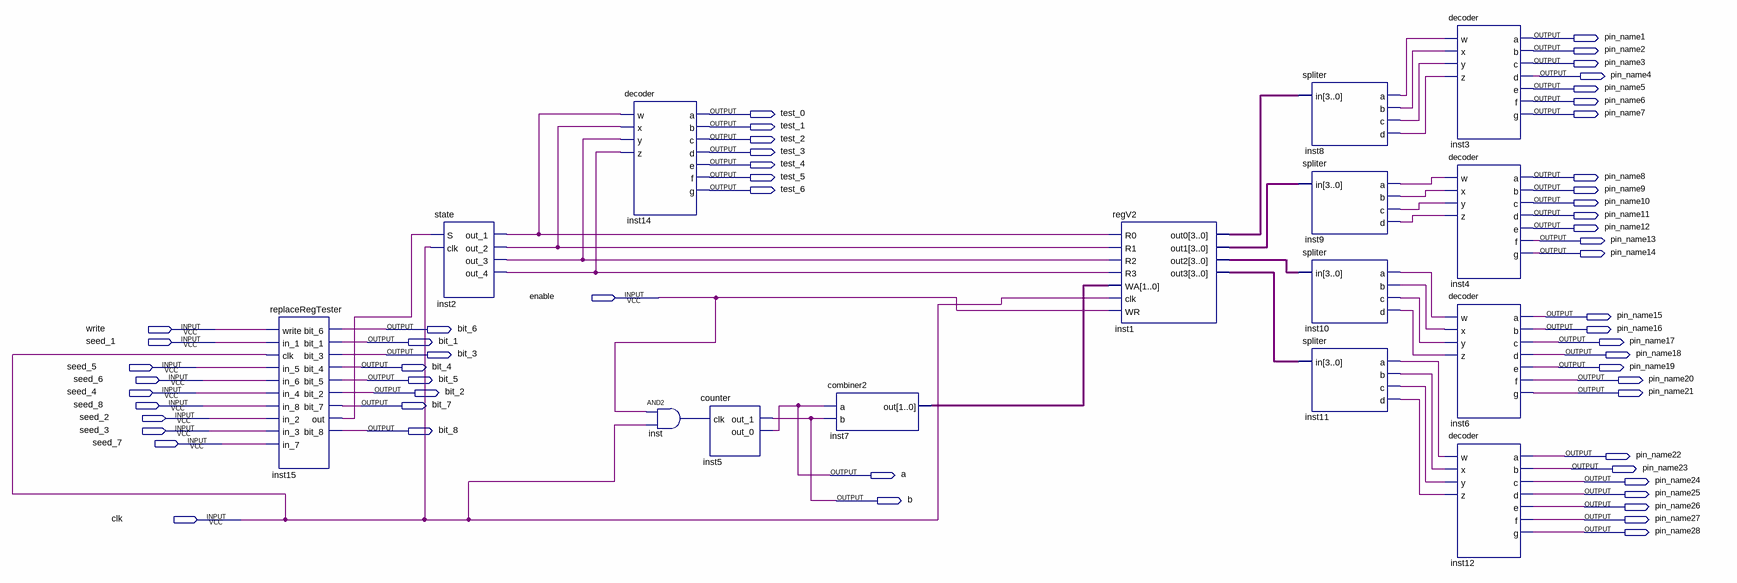
[diagram p0: schematic sheet]
// Quartus schematic generator.bdf as structural Verilog: 15 symbols, 56 pins
module generator (
  input  enable,
  input  write,
  input  seed_1,
  input  seed_5,
  input  seed_6,
  input  seed_4,
  input  seed_8,
  input  seed_2,
  input  seed_3,
  input  seed_7,
  input  clk,
  output pin_name1,
  output pin_name2,
  output pin_name3,
  output pin_name4,
  output pin_name5,
  output pin_name6,
  output test_0,
  output pin_name7,
  output test_1,
  output test_2,
  output test_3,
  output test_4,
  output test_5,
  output pin_name8,
  output test_6,
  output pin_name9,
  output pin_name10,
  output pin_name11,
  output pin_name12,
  output pin_name13,
  output pin_name14,
  output pin_name15,
  output bit_6,
  output pin_name16,
  output bit_1,
  output pin_name17,
  output bit_3,
  output pin_name18,
  output bit_4,
  output pin_name19,
  output bit_5,
  output pin_name20,
  output bit_2,
  output pin_name21,
  output bit_7,
  output bit_8,
  output pin_name22,
  output pin_name23,
  output a,
  output pin_name24,
  output pin_name25,
  output b,
  output pin_name26,
  output pin_name27,
  output pin_name28
);

  wire inst2_out_1, inst2_out_2, inst2_out_3, inst2_out_4, inst8_a, inst8_b, inst8_c, inst8_d, inst9_a,
       inst9_b, inst9_c, inst9_d, inst10_a, inst10_b, inst10_c, inst10_d, inst11_a, inst11_b, inst11_c,
       inst11_d, inst15_out, inst_out;
  wire [1:0] inst7_out;
  wire [3:0] inst1_out0, inst1_out1, inst1_out2, inst1_out3;

  replaceRegTester inst15 (
    .write(write), .in_1(seed_1), .clk(clk), .in_5(seed_5), .in_6(seed_6), .in_4(seed_4), .in_8(seed_8),
    .in_2(seed_2), .in_3(seed_3), .in_7(seed_7), .bit_6(bit_6), .bit_1(bit_1), .bit_3(bit_3), .bit_4(bit_4),
    .bit_5(bit_5), .bit_2(bit_2), .bit_7(bit_7), .out(inst15_out), .bit_8(bit_8));
  state inst2 (
    .S(inst15_out), .clk(clk), .out_1(inst2_out_1), .out_2(inst2_out_2), .out_3(inst2_out_3),
    .out_4(inst2_out_4));
  decoder inst14 (
    .w(inst2_out_1), .x(inst2_out_2), .y(inst2_out_3), .z(inst2_out_4), .a(test_0), .b(test_1), .c(test_2),
    .d(test_3), .e(test_4), .f(test_5), .g(test_6));
  and inst (inst_out, enable, clk);
  counter inst5 (.clk(inst_out), .out_1(b), .out_0(a));
  combiner2 inst7 (.a(a), .b(b), .out(inst7_out));
  regV2 inst1 (
    .R0(inst2_out_1), .R1(inst2_out_2), .R2(inst2_out_3), .R3(inst2_out_4), .WA(inst7_out), .clk(clk),
    .WR(enable), .out0(inst1_out0), .out1(inst1_out1), .out2(inst1_out2), .out3(inst1_out3));
  spliter inst8 (.in(inst1_out0), .a(inst8_a), .b(inst8_b), .c(inst8_c), .d(inst8_d));
  spliter inst9 (.in(inst1_out1), .a(inst9_a), .b(inst9_b), .c(inst9_c), .d(inst9_d));
  spliter inst10 (.in(inst1_out2), .a(inst10_a), .b(inst10_b), .c(inst10_c), .d(inst10_d));
  spliter inst11 (.in(inst1_out3), .a(inst11_a), .b(inst11_b), .c(inst11_c), .d(inst11_d));
  decoder inst3 (
    .w(inst8_a), .x(inst8_b), .y(inst8_c), .z(inst8_d), .a(pin_name1), .b(pin_name2), .c(pin_name3),
    .d(pin_name4), .e(pin_name5), .f(pin_name6), .g(pin_name7));
  decoder inst4 (
    .w(inst9_a), .x(inst9_b), .y(inst9_c), .z(inst9_d), .a(pin_name8), .b(pin_name9), .c(pin_name10),
    .d(pin_name11), .e(pin_name12), .f(pin_name13), .g(pin_name14));
  decoder inst6 (
    .w(inst10_a), .x(inst10_b), .y(inst10_c), .z(inst10_d), .a(pin_name15), .b(pin_name16), .c(pin_name17),
    .d(pin_name18), .e(pin_name19), .f(pin_name20), .g(pin_name21));
  decoder inst12 (
    .w(inst11_a), .x(inst11_b), .y(inst11_c), .z(inst11_d), .a(pin_name22), .b(pin_name23), .c(pin_name24),
    .d(pin_name25), .e(pin_name26), .f(pin_name27), .g(pin_name28));
endmodule
